# Altium schematic sheet UICLED Lite_2021-06-10.schdoc
size 395 x 297 mm
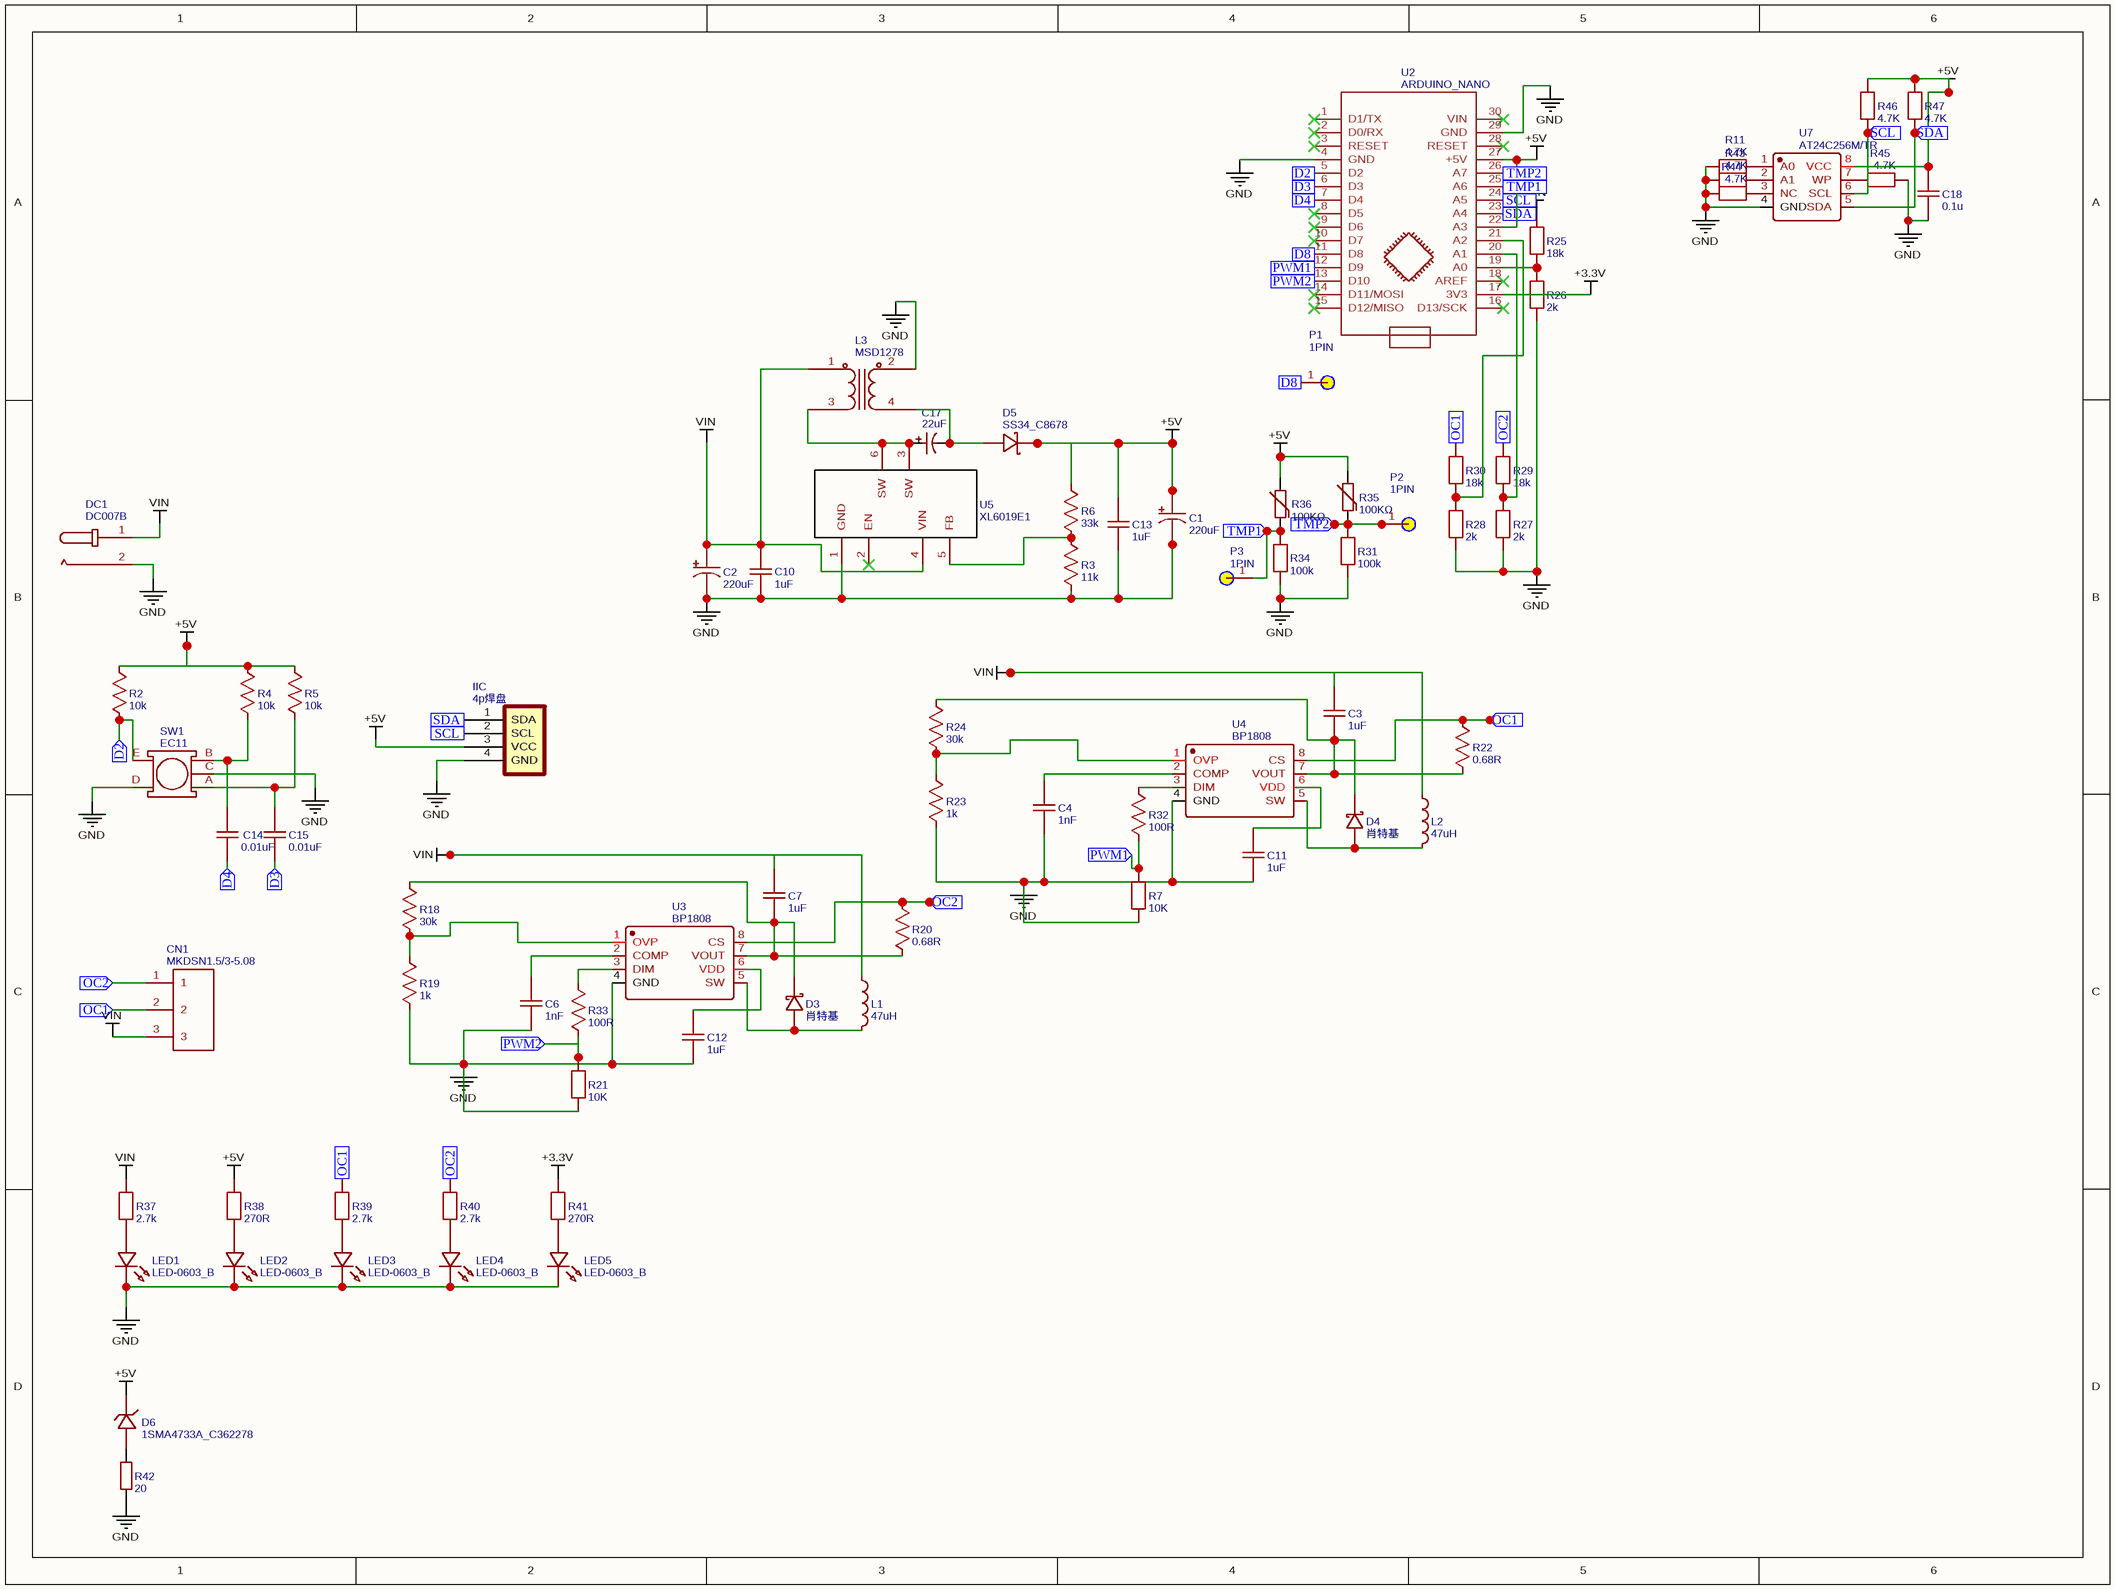
[diagram p0: UICLED Lite_2021-06-10.schdoc]

## Parts
C1  220uF  [CAP-SMD_BD6.3-L6.6-W6.6-FD]
C2  220uF  [CAP-SMD_BD6.3-L6.6-W6.6-FD]
C3  1uF  [C1210]
C4  1nF  [C0603]
C6  1nF  [C0603]
C7  1uF  [C1210]
C10  1uF  [C0603]
C11  1uF  [C0603]
C12  1uF  [C0603]
C13  1uF  [C0603]
C14  0.01uF  [C0603]
C15  0.01uF  [C0603]
C17  22uF  [CAP-SMD_BD6.3-L6.6-W6.6-FD]
C18  0.1u  [C0603]
CN1  MKDSN1.5/3-5.08  [CONN-TH_3P-P5.08_1729131]
D3  肖特基  [DO-214AC_L4.3-W2.7-LS5.3-RD]
D4  肖特基  [DO-214AC_L4.3-W2.7-LS5.3-RD]
D5  SS34_C8678  [DO-214AC_L4.3-W2.7-LS5.3-RD]
D6  1SMA4733A_C362278  [SMA_L4.4-W2.8-LS5.4-RD]
DC1  DC007B  [DC-007B]
IIC  4p焊盘  [HDR1X4]
L1  47uH  [IND-SMD_L11.5-W10.0]
L2  47uH  [IND-SMD_L11.5-W10.0]
L3  MSD1278  [MSD1278]
LED1  LED-0603_B  [LED0603_BLUE]
LED2  LED-0603_B  [LED0603_BLUE]
LED3  LED-0603_B  [LED0603_BLUE]
LED4  LED-0603_B  [LED0603_BLUE]
LED5  LED-0603_B  [LED0603_BLUE]
P1  1PIN  [1P]
P2  1PIN  [1P]
P3  1PIN  [1P]
R2  10k  [R0603]
R3  11k  [R0603]
R4  10k  [R0603]
R5  10k  [R0603]
R6  33k  [R0603]
R7  10K  [R0603]
R11  4.7K  [R0603]
R18  30k  [R0603]
R19  1k  [R0603]
R20  0.68R  [R1210]
R21  10K  [R0603]
R22  0.68R  [R1210]
R23  1k  [R0603]
R24  30k  [R0603]
R25  18k  [R0603]
R26  2k  [R0603]
R27  2k  [R0603]
R28  2k  [R0603]
R29  18k  [R0603]
R30  18k  [R0603]
R31  100k  [R0603]
R32  100R  [R0603]
R33  100R  [R0603]
R34  100k  [R0603]
R35  100KΩ  [R0603]
R36  100KΩ  [R0603]
R37  2.7k  [R0603]
R38  270R  [R0603]
R39  2.7k  [R0603]
R40  2.7k  [R0603]
R41  270R  [R0603]
R42  20  [R1210]
R43  4.7K  [R0603]
R44  4.7K  [R0603]
R45  4.7K  [R0603]
R46  4.7K  [R0603]
R47  4.7K  [R0603]
SW1  EC11  [SW-TH_EC11E15244G1]
U2  ARDUINO_NANO  [ARDUINO_NANO]
U3  BP1808  [SOIC-8_L5.0-W4.0-P1.27-LS6.0-BL-EP]
U4  BP1808  [SOIC-8_L5.0-W4.0-P1.27-LS6.0-BL-EP]
U5  XL6019E1  [TO-263-5_L10.2-W9.9-P1.70-LS14.4-TL]
U7  AT24C256M/TR  [SOP-8_L4.9-W3.9-P1.27-LS6.0-BL]

## Ports
D2 (in), D3 (in), D4 (in), D8 (in), OC1 (in), OC2 (in), PWM1 (in), PWM2 (in), SCL (in), SDA (in), TMP1 (in), TMP2 (in)

## Nets
+3.3V: R41.2 U2.17(3V3)
+5V: C1.1 C13.2 C18.2 D5.1(K) D6.1 IIC.3(VCC) R2.2 R4.2 R5.2 R6.2 R35.2 R36.2 R38.2 R46.2 R47.2 U2.22(A3) U2.27(+5V) U7.8(VCC)
GND: C1.2 C2.2 C4.1 C6.1 C10.1 C11.1 C12.1 C13.1 C18.1 DC1.2 IIC.4(GND) L3.2 LED1.2 LED2.2 LED3.2 LED4.2 LED5.2 R3.1 R7.1 R11.1 R19.1 R21.1 R23.1 R26.1 R27.1 R28.1 R31.1 R34.1 R42.1 R43.1 R44.1 R45.2 SW1.C SW1.D U2.4(GND) U2.29(GND) U3.4(GND) U4.4(GND) U5.1(GND) U7.4(GND)
VIN: C2.1 C3.2 C7.2 C10.2 CN1.3 DC1.1 L1.1 L2.1 L3.1 R25.2 R37.2 U5.4(VIN)
D2: R2.1 SW1.E U2.5(D2) ; port D2
D3: C15.1 U2.6(D3) ; port D3
D4: C14.1 U2.7(D4) ; port D4
D8: P1.1 U2.11(D8) ; port D8
OC1: CN1.2 R22.2 R30.2 R39.2 U4.8(CS) ; port OC1
OC2: CN1.1 R20.2 R29.2 R40.2 U3.8(CS) ; port OC2
PWM1: R7.2 R32.1 U2.12(D9) ; port PWM1
PWM2: R21.2 R33.1 U2.13(D10) ; port PWM2
SCL: IIC.2(SCL) R46.1 U2.24(A5) U7.6(SCL) ; port SCL
SDA: IIC.1(SDA) R47.1 U2.23(A4) U7.5(SDA) ; port SDA
TMP1: P3.1 R34.2 R36.1 U2.25(A6) ; port TMP1
TMP2: P2.1 R31.2 R35.1 U2.26(A7) ; port TMP2
NetC3_1: C3.1 D4.1(K) R22.1 R24.2 U4.7(VOUT)
NetC4_2: C4.2 U4.2(COMP)
NetC6_2: C6.2 U3.2(COMP)
NetC7_1: C7.1 D3.1(K) R18.2 R20.1 U3.7(VOUT)
NetC11_2: C11.2 U4.6(VDD)
NetC12_2: C12.2 U3.6(VDD)
NetC14_2: C14.2 R4.1 SW1.B
NetC15_2: C15.2 R5.1 SW1.A
NetC17_1: C17.1 L3.3 U5.3(SW) U5.6(SW)
NetC17_2: C17.2 D5.2(A) L3.4
NetD3_2: D3.2(A) L1.2 U3.5(SW)
NetD4_2: D4.2(A) L2.2 U4.5(SW)
NetD6_2: D6.2 R42.2
NetLED1_1: LED1.1 R37.1
NetLED2_1: LED2.1 R38.1
NetLED3_1: LED3.1 R39.1
NetLED4_1: LED4.1 R40.1
NetLED5_1: LED5.1 R41.1
NetR3_2: R3.2 R6.1 U5.5(FB)
NetR11_2: R11.2 U7.1(A0)
NetR18_1: R18.1 R19.2 U3.1(OVP)
NetR23_2: R23.2 R24.1 U4.1(OVP)
NetR25_1: R25.1 R26.2 U2.19(A0)
NetR27_2: R27.2 R29.1 U2.20(A1)
NetR28_2: R28.2 R30.1 U2.21(A2)
NetR32_2: R32.2 U4.3(DIM)
NetR33_2: R33.2 U3.3(DIM)
NetR43_2: R43.2 U7.2(A1)
NetR44_2: R44.2 U7.3(NC)
NetR45_1: R45.1 U7.7(WP)

Not connected (* = marked no-connect by the designer): U2 1(D1/TX)* 2(D0/RX)* 3(RESET)* 8(D5)* 9(D6)* 10(D7)* 14(D11/MOSI)* 15(D12/MISO)* 16(D13/SCK)* 18(AREF)* 28(RESET)* 30(VIN)*; U5 2(EN)*

## Library data of the parts
C1 = 220uF: BOM_Manufacturer: HONOR; BOM_Manufacturer Part: RVE0J221M0605; nameAlias: Capacitance; BOM_Supplier: LCSC; BOM_Supplier Part: C88673; spicePre: C; spiceSymbolName: RVE0J221M0605
C2 = 220uF: BOM_Manufacturer: PANASONIC; BOM_Manufacturer Part: EEEFTE221XAP; nameAlias: Capacitance; Contributor: LCSC; BOM_Supplier: LCSC; BOM_Supplier Part: C190724; spicePre: C; spiceSymbolName: EEEFTE221XAP
C3 C7 = 1uF: BOM_Manufacturer: TDK; BOM_Manufacturer Part: CGA6M3X7R1C106KT0Y0N; nameAlias: Capacitance; Contributor: LCSC; BOM_Supplier: LCSC; BOM_Supplier Part: C432950; spicePre: C; spiceSymbolName: CGA6M3X7R1C106KT0Y0N
C4 C6 = 1nF: nameAlias: Value(F); Contributor: LCEDA_Lib; spicePre: C; spiceSymbolName: C_0603_US
C10-C13 = 1uF: nameAlias: Value(F); Contributor: LCEDA_Lib; spicePre: C; spiceSymbolName: C_0603_US
C14 C15 = 0.01uF: nameAlias: Value(F); Contributor: LCEDA_Lib; spicePre: C; spiceSymbolName: C_0603_US
C17 = 22uF: BOM_Manufacturer: ROQANG; BOM_Manufacturer Part: RVT1J220M0607; nameAlias: Capacitance; BOM_Supplier: LCSC; BOM_Supplier Part: C72501; spicePre: C; spiceSymbolName: RVT1J220M0607
C18 = 0.1u: nameAlias: Value(F); Contributor: LCEDA_Lib; spicePre: C; spiceSymbolName: C_0603_US
CN1 = MKDSN1.5/3-5.08: BOM_Manufacturer: Phoenix Contact; BOM_Supplier: LCSC; BOM_Manufacturer Part: MKDSN1.5/3-5.08; BOM_Supplier Part: C91154; spicePre: C; spiceSymbolName: MKDSN1.5/3-5.08
D3 D4 = 肖特基: BOM_Manufacturer: VISHAY; BOM_Manufacturer Part: SS14-E3/61T; SMT Type: Extend; Package Display: No; BOM_Supplier: LCSC; image: //image.lceda.cn/szlcsc/C47460.jpg; BOM_Supplier Part: C47460; BOM_LCSC Assembly: Yes; spicePre: D; spiceSymbolName: SS14-E3/61T
D5 = SS34_C8678: BOM_Manufacturer Part: SS34; BOM_Manufacturer: MDD; SMT Type: Basic; BOM_Supplier: LCSC; image: //image.lceda.cn/szlcsc/C8678.jpg; BOM_Supplier Part: C8678; BOM_JLCPCB SMD: Yes; spicePre: D; spiceSymbolName: SS34_C8678
D6 = 1SMA4733A_C362278: BOM_Manufacturer: LGE; Contributor: LCSC; SMT Type: Extend; BOM_Supplier: LCSC; BOM_Supplier Part: C362278; BOM_Manufacturer Part: 1SMA4733A; BOM_JLCPCB SMD: Yes; spicePre: D; spiceSymbolName: 1SMA4733A_C362278
DC1 = DC007B: Contributor: Keridium; BOM_Supplier: LCSC; spicePre: D; spiceSymbolName: DC007B
IIC = 4p焊盘: Contributor: UICalc; spicePre: B; spiceSymbolName: 4p焊盘
L1 L2 = 47uH: BOM_Manufacturer: SXN; BOM_Manufacturer Part: SMMS1050-470M; nameAlias: Inductance; Contributor: LCSC; BOM_Supplier: LCSC; BOM_Supplier Part: C149548; spicePre: L; spiceSymbolName: SMMS1050-470M
L3 = MSD1278: Contributor: leo_plus; spicePre: L; spiceSymbolName: MSD1278
LED1-LED5 = LED-0603_B: BOM_Manufacturer: EVERLIGHT(台湾亿光); BOM_Manufacturer Part: 19-217/BHC-ZL1M2RY/3T; Contributor: LCEDA_01; BOM_Supplier Part: C72041; BOM_Supplier: LCSC; spicePre: L; spiceSymbolName: LED-0603_B
P1-P3 = 1PIN: Contributor: m233; spicePre: P; spiceSymbolName: 1PIN
R2 R4 R5 = 10k: nameAlias: Value(Ω); Contributor: LCEDA_Lib; spicePre: R; spiceSymbolName: R_0603_US
R3 = 11k: nameAlias: Value(Ω); Contributor: LCEDA_Lib; spicePre: R; spiceSymbolName: R_0603_US
R6 = 33k: nameAlias: Value(Ω); Contributor: LCEDA_Lib; spicePre: R; spiceSymbolName: R_0603_US
R7 R21 = 10K: nameAlias: Value(Ω); Contributor: LCEDA_Lib; spicePre: R; spiceSymbolName: R_0603_EU
R11 R43-R47 = 4.7K: nameAlias: Value(Ω); Contributor: LCEDA_Lib; spicePre: R; spiceSymbolName: R_0603_EU
R18 R24 = 30k: nameAlias: Value(Ω); Contributor: LCEDA_Lib; spicePre: R; spiceSymbolName: R_0603_US
R19 R23 = 1k: nameAlias: Value(Ω); Contributor: LCEDA_Lib; spicePre: R; spiceSymbolName: R_0603_US
R20 R22 = 0.68R: nameAlias: Value(Ω); Contributor: LCEDA_Lib; spicePre: R; spiceSymbolName: R_1210_US
R25 R29 R30 = 18k: nameAlias: Value(Ω); Contributor: LCEDA_Lib; spicePre: R; spiceSymbolName: R_0603_EU
R26-R28 = 2k: nameAlias: Value(Ω); Contributor: LCEDA_Lib; spicePre: R; spiceSymbolName: R_0603_EU
R31 R34 = 100k: nameAlias: Value(Ω); Contributor: LCEDA_Lib; spicePre: R; spiceSymbolName: R_0603_EU
R32 R33 = 100R: nameAlias: Value(Ω); Contributor: LCEDA_Lib; spicePre: R; spiceSymbolName: R_0603_US
R35 R36 = 100KΩ: BOM_Manufacturer: MuRata; BOM_Manufacturer Part: NCP18WF104F12RB; nameAlias: Value; BOM_Supplier: LCSC; BOM_Supplier Part: C71280; spicePre: R; spiceSymbolName: NCP18WF104F12RB
R37 R39 R40 = 2.7k: nameAlias: Value(Ω); Contributor: LCEDA_Lib; spicePre: R; spiceSymbolName: R_0603_EU
R38 R41 = 270R: nameAlias: Value(Ω); Contributor: LCEDA_Lib; spicePre: R; spiceSymbolName: R_0603_EU
R42 = 20: BOM_Manufacturer: UniOhm; BOM_Manufacturer Part: 1210W3F200JT5E; nameAlias: Resistance (Ohms); SMT Type: Extend; BOM_Supplier: LCSC; BOM_Supplier Part: C32486; BOM_JLCPCB SMD: Yes; spicePre: R; spiceSymbolName: 1210W3F200JT5E
SW1 = EC11: BOM_Manufacturer: ALPS Electric; BOM_Manufacturer Part: EC11E09244BS; Contributor: zz1017; Package Display: No; BOM_Supplier: LCSC; BOM_Supplier Part: C470742; spicePre: S; spiceSymbolName: EC11
U2 = ARDUINO_NANO: sourceId: KGSeAWhDB; timeStamp: 1452340004; spicePre: U; spiceSymbolName: ARDUINO_NANO
U3 U4 = BP1808: BOM_Manufacturer: BPS; SMT Type: Extend; BOM_Supplier: LCSC; BOM_Manufacturer Part: BP1808; BOM_Supplier Part: C85659; BOM_LCSC Assembly: Yes; spicePre: U; spiceSymbolName: BP1808
U5 = XL6019E1: BOM_Manufacturer: XLSEMI; SMT Type: Extend; BOM_Supplier: LCSC; BOM_Manufacturer Part: XL6019E1; image: //image.lceda.cn/szlcsc/C73018.jpg; BOM_Supplier Part: C73018; BOM_JLCPCB SMD: Yes; spicePre: U; spiceSymbolName: XL6019E1
U7 = AT24C256M/TR: BOM_Manufacturer: HGSEMI; Contributor: LCSC; BOM_Supplier: LCSC; BOM_Supplier Part: C434513; BOM_Manufacturer Part: AT24C256M/TR; spicePre: U; spiceSymbolName: AT24C256M/TR